# Altium schematic sheet AMU-S10-V00-Buzzer.SchDoc: Shutdown Buzzer
size A3; DrawnBy: Jonn Dillon; DocumentNumber: 10; SheetNumber: 10; SheetTotal: 12
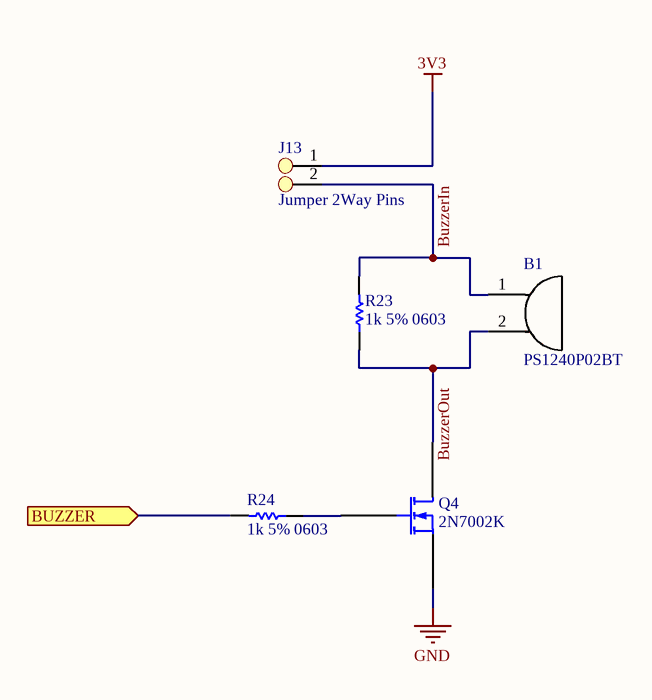
[diagram p0: AMU-S10-V00-Buzzer.SchDoc]

## Parts
B1  PS1240P02BT  [PS1240P02BT]
J13  Jumper 2Way Pins  [Jumper_2Way_Pin]
Q4  2N7002K  [SOT-23-3]
R23  1k 5% 0603  [Res_ThinFilm_0603]
R24  1k 5% 0603  [Res_ThinFilm_0603]

## Ports
BUZZER (in)

## Nets
3V3: J13.1
GND: Q4.S
BUZZER: R24.2 ; port BUZZER
BuzzerIn: B1.1 J13.2 R23.2
BuzzerOut: B1.2 Q4.D R23.1
NetQ4_G: Q4.G R24.1

## Notes on the sheet
- Revision History:
- Sheet Title:
- Rev
- Date
- Description
- Project:
- Size:
- Drawn By:
- A3
- Number:
- Revision:
- Sheet
- Version:
- of
- QUT Motorsport
- O-120, Gardens Point
- 2 George Street
- Brisbane, QLD 4000
- Australia
- Print Date:
- Print Time:
- File Name:

## Library data of the parts
B1 = PS1240P02BT: Buzzers Transducer, Externally Driven Piezo 3V 4kHz 60dB @ 3V, 10cm Through Hole PC Pins
J13 = Jumper 2Way Side Pins
Q4 = 2N7002K: N-Channel 60V 300mA (Ta) 350mW (Ta) Surface Mount SOT-23 (TO-236AB)
R23 R24 = 1k 5% 0603: Resistor, SMD, 1k, 0.1W, 5%, 0603